# EAGLE board RFIDLER V22 beta (EAGLE 6.5.0), part 1 of 2
VERSION: 5
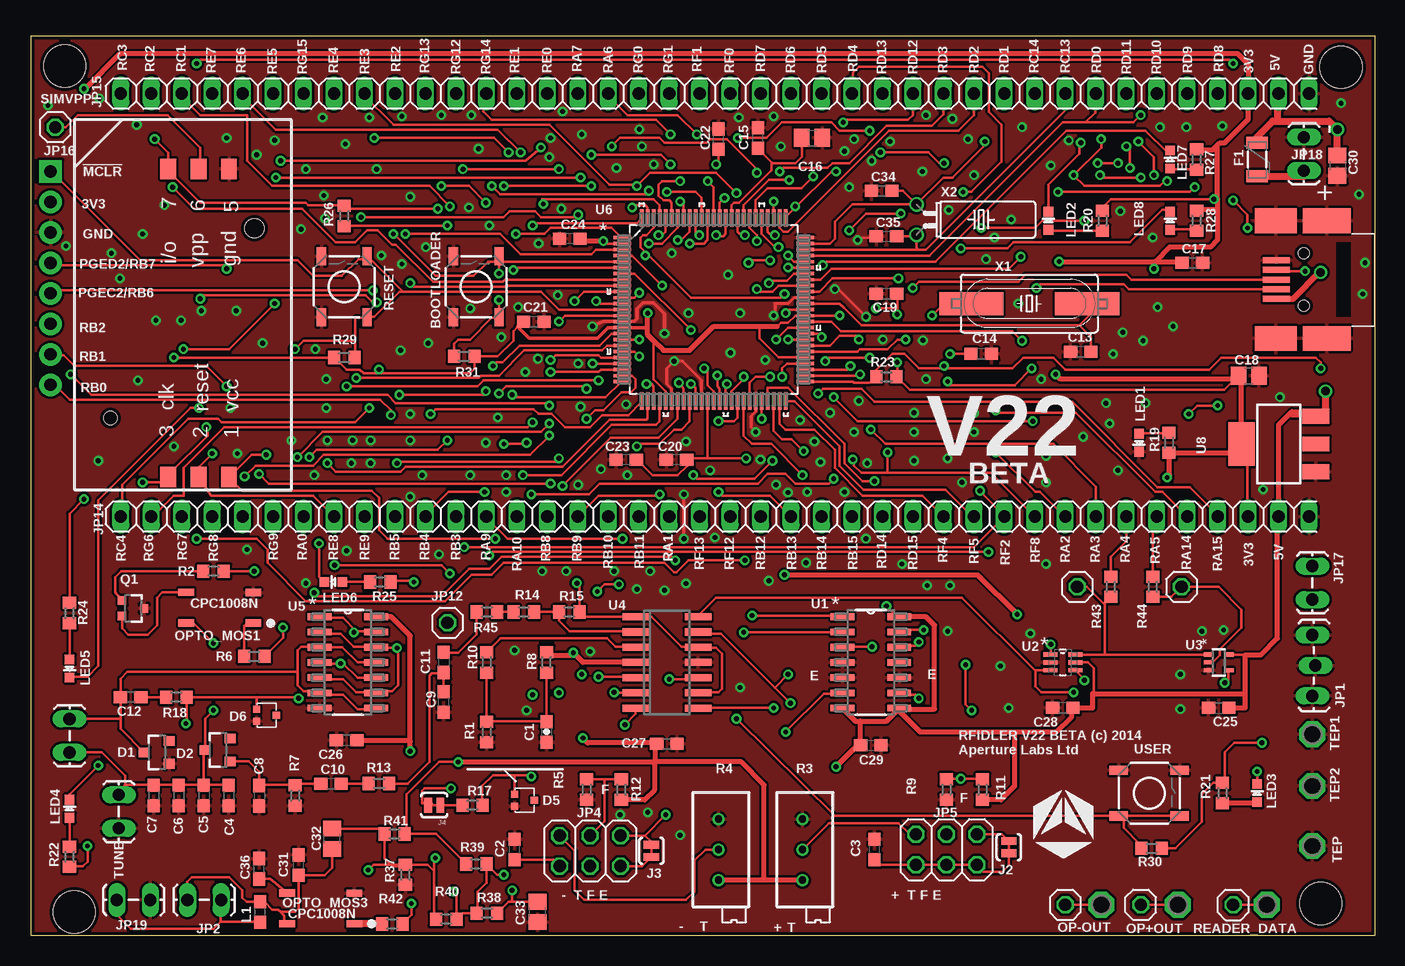
[diagram p2: board, top side]
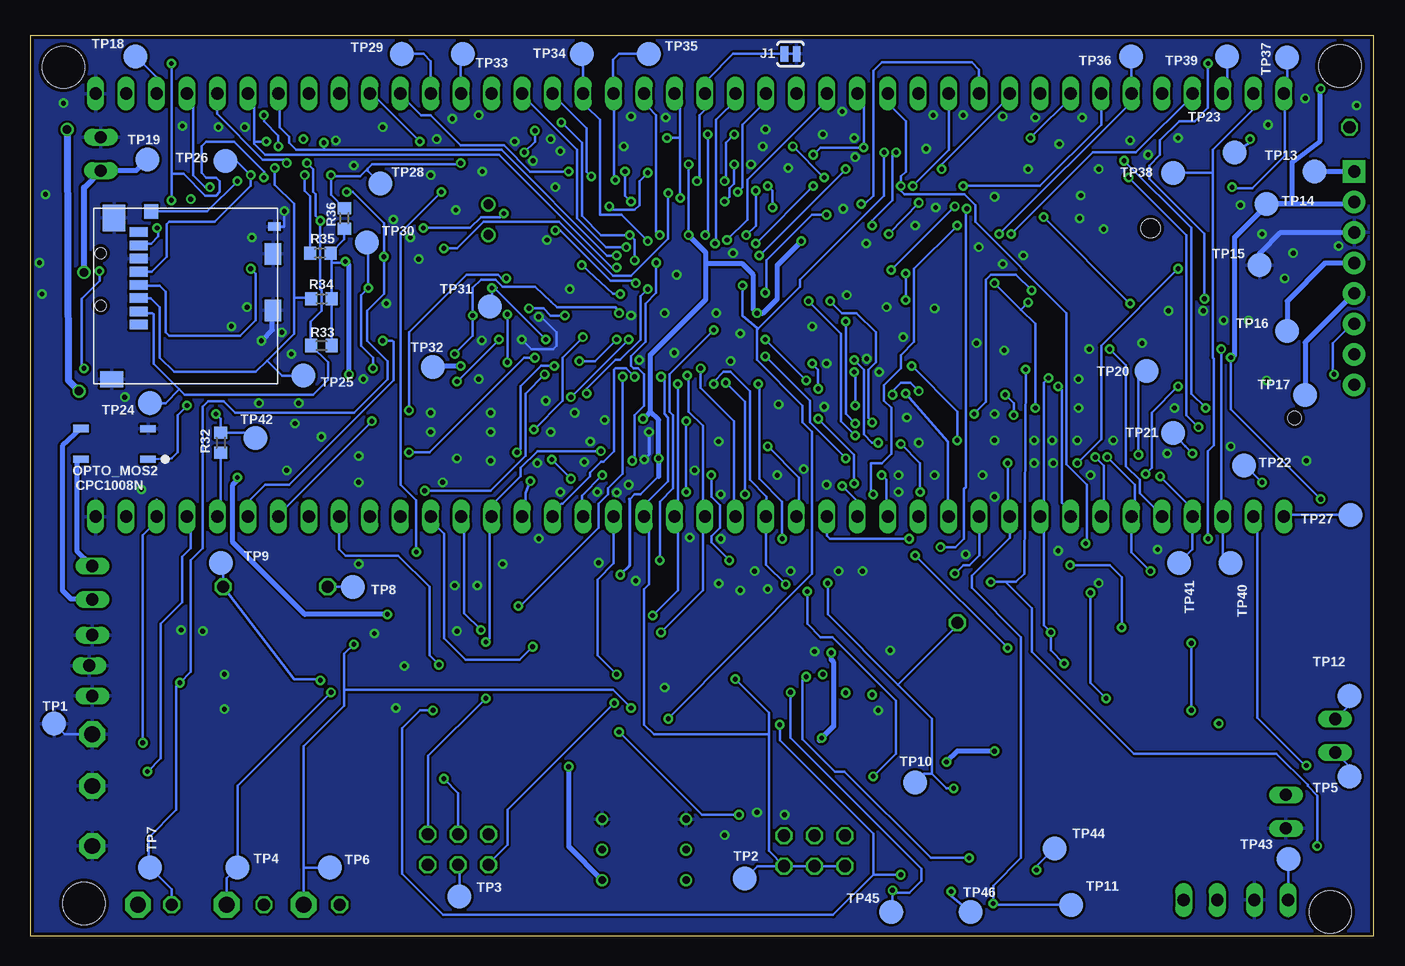
[diagram p3: board, bottom side, seen from below]

Size 112 x 75 mm. Coordinates in mm from the lower left corner, seen from the top.
Outline: 0,75 112,75 112,0 0,0 0,75
Copper layers (1*16): Top 0.035mm / dielectric 1.5mm / Bottom 0.035mm
Design rules "cleveland rfidler v20": minimum track width 0.2mm, minimum drill 0.4mm, track to track 0.2mm, track to pad 0.2mm, pad to pad 0.2mm, via to via 0.2mm, smd to smd 0.125mm, copper to edge 0.3mm, drill to drill 0.2mm, minimum pad ring 0.2mm, minimum via ring 0.2mm, stop-mask expansion 0.075mm, vias tented up to drill 0.5mm, thermal gap 0.2mm
Net classes: 1 power: width 0.25 mm, drill 0.4 mm, clearance 0.2 mm
Holes 3.5 mm at 2.8,72.5 3.6,2 109.2,72.4 107.5,2.7

## Footprints (pad centres in the part's own frame; a part is rotated, then mirrored left to right if it is on the bottom)
TACTILE_SWITCH_SMD = smd 1.524 x 0.762: 1 -2.54,1.905; 2 2.54,1.905; 3 -2.54,-1.905; 4 2.54,-1.905
0603-CAP = smd 1.1 x 1: 1 -0.85,0; 2 0.85,0
C0603 = smd 1.1 x 1: 1 -0.85,0; 2 0.85,0
C0805 = smd 1.3 x 1.5: 1 -0.85,0; 2 0.85,0
SOT23-3 = smd 0.8 x 0.9: 1 -0.95,-1; 2 0.95,-1; 3 0,1.1
SOT663 = smd 0.6 x 0.6: P$1 1.015,-0.5; P$2 1.015,0.5; P$3 -0.635,0
PTC-1206 = smd 1 x 1.8: 1 -1.4,0; 2 1.4,0
SJ_2S-TRACE = smd 0.635 x 1.27: 1 -0.508,0; 2 0.508,0
1X03_LOCK_LONGPADS = drill 1.016 long: 1 0,0; 2 2.54,-0.254; 3 5.08,0
1X02_LOCK_LONGPADS = drill 1.016 long: 1 -0.127,0; 2 2.667,0
2X03 = drill 1.016 octagon: 1 -2.54,-1.27; 2 -2.54,1.27; 3 0,-1.27; 4 0,1.27; 5 2.54,-1.27; 6 2.54,1.27
1X01 = drill 1.016 octagon: 1 0,0
1X40 = drill 1.016 long: 1 -49.53,0; 2 -46.99,0; 3 -44.45,0; 4 -41.91,0; 5 -39.37,0; 6 -36.83,0; 7 -34.29,0; 8 -31.75,0; 9 -29.21,0; 10 -26.67,0; 11 -24.13,0; 12 -21.59,0; 13 -19.05,0; 14 -16.51,0; 15 -13.97,0; 16 -11.43,0; 17 -8.89,0; 18 -6.35,0; 19 -3.81,0; 20 -1.27,0; 21 1.27,0; 22 3.81,0; 23 6.35,0; 24 8.89,0; 25 11.43,0; 26 13.97,0; 27 16.51,0; 28 19.05,0; 29 21.59,0; 30 24.13,0; 31 26.67,0; 32 29.21,0; 33 31.75,0; 34 34.29,0; 35 36.83,0; 36 39.37,0; 37 41.91,0; 38 44.45,0; 39 46.99,0; 40 49.53,0
1X08 = drill 1.016 pad 1.88 square: 1 0,0 | drill 1.016 pad 1.88: 2 2.54,0; 3 5.08,0; 4 7.62,0; 5 10.16,0; 6 12.7,0; 7 15.24,0; 8 17.78,0
0603 = smd 1.1 x 1: 1 -0.85,0; 2 0.85,0
LED-0603 = smd 0.8 x 0.8: A 0,-0.75; C 0,0.75
P1-13 = drill 1.321 pad 2.159 octagon: TP 0,0
CPC1008N = smd 0.6 x 1.3: A 1.27,2.54; C -1.27,2.54; COM -1.29,-3.06; NO 1.27,-3.06
SOT323 = smd 0.7 x 0.7: 1 -0.65,-0.925; 2 0.65,-0.925; 3 0,0.925
R0603 = smd 1 x 1.1: 1 -0.85,0; 2 0.85,0
RTRIMT93XA = drill 0.61: 1 0,-2.54; 2 0,0; 3 0,2.54
TP20R = smd 2 x 2: TP 0,0
SOIC127P600X175-14N = smd 1.981 x 0.559: 1 -2.362,3.81; 2 -2.362,2.54; 3 -2.362,1.27; 4 -2.362,0; 5 -2.362,-1.27; 6 -2.362,-2.54; 7 -2.362,-3.81; 8 2.362,-3.81; 9 2.362,-2.54; 10 2.362,-1.27; 11 2.362,0; 12 2.362,1.27; 13 2.362,2.54; 14 2.362,3.81
SOT65P210X110-6N = smd 1.168 x 0.356: 1 -1.041,0.66; 2 -1.041,0; 3 -1.041,-0.66; 4 1.041,-0.66; 5 1.041,0; 6 1.041,0.66
SC70-5L = smd 0.35 x 0.8: 1 -0.65,-0.85; 2 0,-0.85; 3 0.65,-0.85; 4 0.65,0.85; 5 -0.65,0.85
SO14 = smd 0.6 x 2.2: 1 -3.81,-2.6; 2 -2.54,-2.6; 3 -1.27,-2.6; 4 0,-2.6; 5 1.27,-2.6; 6 2.54,-2.6; 7 3.81,-2.6; 8 3.81,2.6; 9 2.54,2.6; 10 1.27,2.6; 11 0,2.6; 12 -1.27,2.6; 13 -2.54,2.6; 14 -3.81,2.6
QFP50P1600X1600X120-100N = smd 1.473 x 0.279: 1 -7.62,5.994; 2 -7.62,5.512; 3 -7.62,5.004; 4 -7.62,4.496; 5 -7.62,3.988; 6 -7.62,3.505; 7 -7.62,2.997; 8 -7.62,2.489; 9 -7.62,2.007; 10 -7.62,1.499; 11 -7.62,0.991; 12 -7.62,0.508; 13 -7.62,0; 14 -7.62,-0.508; 15 -7.62,-0.991; 16 -7.62,-1.499; 17 -7.62,-2.007; 18 -7.62,-2.489; 19 -7.62,-2.997; 20 -7.62,-3.505; 21 -7.62,-3.988; 22 -7.62,-4.496; 23 -7.62,-5.004; 24 -7.62,-5.512; 25 -7.62,-5.994; 51 7.62,-5.994; 52 7.62,-5.512; 53 7.62,-5.004; 54 7.62,-4.496; 55 7.62,-3.988; 56 7.62,-3.505; 57 7.62,-2.997; 58 7.62,-2.489; 59 7.62,-2.007; 60 7.62,-1.499; 61 7.62,-0.991; 62 7.62,-0.508; 63 7.62,0; 64 7.62,0.508; 65 7.62,0.991; 66 7.62,1.499; 67 7.62,2.007; 68 7.62,2.489; 69 7.62,2.997; 70 7.62,3.505; 71 7.62,3.988; 72 7.62,4.496; 73 7.62,5.004; 74 7.62,5.512; 75 7.62,5.994 | smd 0.279 x 1.473: 26 -5.994,-7.62; 27 -5.512,-7.62; 28 -5.004,-7.62; 29 -4.496,-7.62; 30 -3.988,-7.62; 31 -3.505,-7.62; 32 -2.997,-7.62; 33 -2.489,-7.62; 34 -2.007,-7.62; 35 -1.499,-7.62; 36 -0.991,-7.62; 37 -0.508,-7.62; 38 0,-7.62; 39 0.508,-7.62; 40 0.991,-7.62; 41 1.499,-7.62; 42 2.007,-7.62; 43 2.489,-7.62; 44 2.997,-7.62; 45 3.505,-7.62; 46 3.988,-7.62; 47 4.496,-7.62; 48 5.004,-7.62; 49 5.512,-7.62; 50 5.994,-7.62; 76 5.994,7.62; 77 5.512,7.62; 78 5.004,7.62; 79 4.496,7.62; 80 3.988,7.62; 81 3.505,7.62; 82 2.997,7.62; 83 2.489,7.62; 84 2.007,7.62; 85 1.499,7.62; 86 0.991,7.62; 87 0.508,7.62; 88 0,7.62; 89 -0.508,7.62; 90 -0.991,7.62; 91 -1.499,7.62; 92 -2.007,7.62; 93 -2.489,7.62; 94 -2.997,7.62; 95 -3.505,7.62; 96 -3.988,7.62; 97 -4.496,7.62; 98 -5.004,7.62; 99 -5.512,7.62; 100 -5.994,7.62
SIM_CARD_CONN = smd 1.7 x 1.3: CARD_CLK_PIN3 -10.16,5.08; CARD_GND_PIN5 15.52,0; CARD_IO_PIN7 15.52,5.08; CARD_RESET_PIN2 -10.16,2.54; CARD_VCC_PIN1 -10.16,0; CARD_VPP_PIN6 15.52,2.54 | hole 1.6: 10.58,-2.1 | hole 1.1: -5.22,9.9
SOT223 = smd 1.219 x 2.235: P$1 -2.311,-3.099; P$2@1 0,-3.099; P$3 2.311,-3.099 | smd 3.6 x 2.2: P$2@2 0,3.099
USB_MINI_B_FARN1125348 = smd 2.25 x 0.5: D+ 0,0; D- 0,0.8; GND 0,-1.6; ID 0,-0.8; VBUS 0,1.6 | smd 4 x 2.05: GND@1 -4.2,-4.9; GND@4 -4.2,4.9 | smd 3.5 x 2.05: GND@2 0.05,-4.9; GND@3 0.05,4.9 | hole 0.9: -2.3,2.2; -2.3,-2.2
MICROSD_TE2201778-1_FARN-234-5280 = smd 0.8 x 1.5: 1 3.85,-0.75; 2 2.75,-0.75; 3 1.65,-0.75; 4 0.55,-0.75; 5 -0.55,-0.75; 6 -1.65,-0.75; 7 -2.75,-0.75; 8 -3.85,-0.75 | smd 1.2 x 1.16: A -5.59,0.3 | smd 0.7 x 1.05: B -4.32,10.59 | smd 1.8 x 1.4: GND -2.04,10.45; GND@1 2.66,10.45 | smd 2.21 x 1.9: GND@2 -5.05,-2.8 | smd 1.35 x 1.9: GND@3 8.4,-3
HC49UP = smd 5.334 x 1.93: 1 -4.826,0; 2 4.826,0
TC38H = drill 0.813: 1 -1.27,0; 2 1.27,0

## Placement (x,y rotation side)
BOOTLOADER  [TACTILE_SWITCH_SMD]  37.1,54.1 90 top
C1  100nF  [0603-CAP]  42.96,17 270 top
C2  100nF  [C0603]  40.3,7.2 90 top
C3  100nF  [C0603]  70.3,7.2 90 top
C4  TUNE  [C0603]  16.45,11.7 270 top
C5  TUNE  [C0603]  14.4,11.7 270 top
C6  TUNE  [C0603]  12.3,11.7 270 top
C7  4.3nF  [C0603]  10.2,11.7 270 top
C8  1nF  [C0603]  19.02,11.69 270 top
C9  1nF  [C0603]  34.4,19.5 90 top
C10  15nf  [C0603]  25,12.7 0 top
C11  100nF  [C0603]  34.4,22.8 270 top
C12  1nF  [C0603]  8.3,19.9 180 top
C13  18pF  [C0603]  87.5,48.7 0 top
C14  18pF  [C0603]  79.2,48.5 180 top
C15  100nf  [C0603]  60.6,66.5 90 top
C16  10uF  [C0805]  65.1,66.5 0 top
C17  100nF  [C0603]  96.8,56.1 0 top
C18  22uF  [C0805]  101.5,46.7 0 top
C19  100nF  [C0603]  71.3,53.5 180 top
C20  100nF  [C0603]  53.8,39.7 180 top
C21  100nF  [C0603]  41.9,51.2 0 top
C22  100nf  [C0603]  57.3,66.4 90 top
C23  100nF  [C0603]  49.6,39.7 180 top
C24  100nF  [C0603]  44.9,58.1 180 top
C25  10nF  [C0603]  99,19 0 top
C26  10nF  [C0603]  26.3,16.3 180 top
C27  10nF  [C0603]  53,16.01 0 top
C28  10nF  [C0603]  86,19 180 top
C29  10nF  [C0603]  70,15.9 0 top
C30  10uF  [C0805]  108.9,64.2 270 top
C31  1nF  [C0603]  22.3,5.9 90 top
C32  10uF  [C0805]  25.1,8.1 90 top
C33  10uF  [C0805]  42.2,2 90 top
C34  12pF  [C0603]  70.9,62.1 0 top
C35  12pF  [C0603]  71.3,58.3 0 top
C36  1nF  [C0603]  19,5.6 90 top
D1  MMDB4148  [SOT23-3]  10.5,15.3 90 top
D2  MMDB4148  [SOT23-3]  15.6,15.5 90 top
D5  BZB984-C3V0  [SOT663]  41.3,11.3 180 top
D6  BZB984-C3V0  [SOT663]  19.8,18.4 180 top
F1  250ma  [PTC-1206]  102.2,64.7 270 top
J1  CUT TO USE RF1  [SJ_2S-TRACE]  48.6,73.5 0 bottom
J2  CUT TO USE FIXED R OR TRIM POT  [SJ_2S-TRACE]  81.5,7.4 90 top
J3  CUT TO USE FIXED R OR TRIM POT  [SJ_2S-TRACE]  51.7,7.1 90 top
J4  [SJ_2S-TRACE]  33.6,10.9 180 top
JP1  [1X03_LOCK_LONGPADS]  106.8,20 90 top
JP2  [1X02_LOCK_LONGPADS]  15.7,3 180 top
JP4  [2X03]  46.6,7.1 0 top
JP5  [2X03]  76.3,7.2 0 top
JP6  [1X01]  92.5,2.6 180 top
JP7  [1X01]  86.2,2.6 0 top
JP8  [1X01]  100.2,2.6 90 top
JP9  [1X01]  87.2,29.1 0 top
JP10  [1X01]  95.9,29.1 0 top
JP11  [1X02_LOCK_LONGPADS]  3.2,15.42 90 top
JP12  [1X01]  34.7,26.1 0 top
JP14  [1X40]  57,34.95 0 top
JP15  [1X40]  57,70.2 0 top
JP16  [1X08]  1.61,63.71 270 top
JP17  [1X02_LOCK_LONGPADS]  106.8,30.7 270 top
JP18  [1X02_LOCK_LONGPADS]  106.1,63.9 90 top
JP19  [1X02_LOCK_LONGPADS]  9.8,3 180 top
L1  [0603]  19.1,2 90 top
LED1  POWER blue  [LED-0603]  92.35,41.1 180 top
LED2  ERROR red  [LED-0603]  84.8,59.6 0 top
LED3  USER_LED yel  [LED-0603]  102.2,11.9 0 top
LED4  READ grn  [LED-0603]  3.2,10.6 0 top
LED5  EMULATE red  [LED-0603]  3.2,22.3 180 top
LED6  CLOCK oran  [LED-0603]  25.2,29.5 90 top
LED7  COMMS ACTIVITY yel  [LED-0603]  94.95,64.7 0 top
LED8  USB grn  [LED-0603]  94.95,59.6 0 top
OP+OUT  TPPAD1-13  [P1-13]  95.6,2.6 90 top
OP-OUT  TPPAD1-13  [P1-13]  89.2,2.6 0 top
OPTO_MOS1  CPC1008N  [CPC1008N]  15.98,27.35 270 top
OPTO_MOS2  CPC1008N  [CPC1008N]  104.7,41 270 bottom
OPTO_MOS3  CPC1008N  [CPC1008N]  24.4,2.3 270 top
Q1  2N3904  [SOT323]  8.5,27.3 270 top
R1  100K  [R0603]  37.97,17 270 top
R2  1k  [R0603]  15.2,30.4 0 top
R3  100k  [RTRIMT93XA]  64.3,7.2 180 top
R4  100k  [RTRIMT93XA]  57.3,7.2 180 top
R5  100k  [R0603]  46.3,12.2 270 top
R6  330  [R0603]  18.6,23.3 180 top
R7  1M  [R0603]  22.01,11.7 90 top
R8  100K  [R0603]  42.96,22.8 270 top
R9  100k  [R0603]  76.3,12.2 270 top
R10  1M  [R0603]  37.97,22.8 90 top
R11  100k  [R0603]  79.3,12.2 90 top
R12  100k  [R0603]  49.2,12.2 90 top
R13  8K06  [R0603]  29,12.7 180 top
R14  4k7  [R0603]  41.07,27 180 top
R15  220K  [R0603]  44.86,27 180 top
R17  470  [R0603]  36.8,10.9 180 top
R18  470  [R0603]  12.1,19.9 180 top
R19  330  [R0603]  94.85,41.1 270 top
R20  330  [R0603]  89.3,59.6 90 top
R21  330  [R0603]  99.3,11.9 90 top
R22  330  [R0603]  3.2,6.6 270 top
R23  10k  [R0603]  71.3,46.6 180 top
R24  330  [R0603]  3.2,26.9 90 top
R25  330  [R0603]  29.1,29.5 0 top
R26  4K7  [R0603]  26.1,60 90 top
R27  330  [R0603]  97.15,64.7 90 top
R28  330  [R0603]  97.15,59.6 90 top
R29  10K  [R0603]  26.1,48.2 0 top
R30  10K  [R0603]  93.4,7.3 180 top
R31  10K  [R0603]  36.1,48.3 180 top
R32  330  [R0603]  96.1,41.1 90 bottom
R33  10K  [R0603]  87.7,49.2 180 bottom
R34  10K  [R0603]  87.7,53.1 180 bottom
R35  10K  [R0603]  87.8,56.9 180 bottom
R36  10K  [R0603]  85.8,59.8 90 bottom
R37  100K  [R0603]  31.2,5.1 270 top
R38  47K  [R0603]  38,1.9 180 top
R39  1K  [R0603]  37.1,6 180 top
R40  100K  [R0603]  34.6,1.4 180 top
R41  100K  [R0603]  30.3,8.5 180 top
R42  330  [R0603]  30.1,1 180 top
R43  0R  [R0603]  90,29.1 90 top
R44  0R  [R0603]  93.5,29.1 90 top
R45  12K  [R0603]  38,27 180 top
READER_DATA  TPPAD1-13  [P1-13]  103,2.6 270 top
RESET  [TACTILE_SWITCH_SMD]  26.1,54.1 90 top
SIMVPP  [1X01]  2,67.4 0 top
TEP  TPPAD1-13  [P1-13]  106.8,7.5 180 top
TEP1  TPPAD1-13  [P1-13]  106.8,16.8 180 top
TEP2  TPPAD1-13  [P1-13]  106.8,12.5 180 top
TP1  DOWNS_ORIN1  [TP20R]  110,17.7 0 bottom
TP2  DIV-  [TP20R]  52.4,4.8 0 bottom
TP3  DIV+  [TP20R]  76.2,3.3 0 bottom
TP4  OP-OUT  [TP20R]  94.7,5.7 0 bottom
TP5  COIL_B  [TP20R]  2,13.3 0 bottom
TP6  OP+OUT  [TP20R]  87,5.7 0 bottom
TP7  READER_DATA  [TP20R]  102,5.7 0 bottom
TP8  UPS_ORIN1  [TP20R]  85.1,29.1 0 bottom
TP9  DOWNS_ORIN1  [TP20R]  96.1,31.1 0 bottom
TP10  RAW_READER_OUT  [TP20R]  38.2,12.8 0 bottom
TP11  LC_CAL  [TP20R]  25.2,2.6 0 bottom
TP12  COIL_A  [TP20R]  2,20 0 bottom
TP13  !MCLR  [TP20R]  4.9,63.7 0 bottom
TP14  3V3  [TP20R]  8.9,61 0 bottom
TP15  GND  [TP20R]  9.5,55.9 0 bottom
TP16  PGD2  [TP20R]  7.2,50.4 0 bottom
TP17  PGC2  [TP20R]  5.7,45.1 0 bottom
TP18  DOWNS_ORIN1  [TP20R]  103.2,73.3 0 bottom
TP19  POWER_IN_5V0  [TP20R]  102.2,64.7 0 bottom
TP20  SMARTCARD_VCC  [TP20R]  18.9,47.1 0 bottom
TP21  SMARTCARD_RESET  [TP20R]  16.7,41.9 0 bottom
TP22  SMARTCARD_CLOCK  [TP20R]  10.8,39.2 0 bottom
TP23  SMARTCARD_TX_PIC_RX  [TP20R]  11.6,65.3 0 bottom
TP24  PIC_!SS1  [TP20R]  102,44.4 0 bottom
TP25  PIC_SDO1  [TP20R]  89.2,46.7 0 bottom
TP26  PIC_SCK1  [TP20R]  95.7,64.6 0 bottom
TP27  PIC_SDI1  [TP20R]  1.9,35.1 0 bottom
TP28  SD_CARD_DETECT  [TP20R]  82.8,62.7 0 bottom
TP29  WIEGAND_1_OUT  [TP20R]  81,73.5 90 bottom
TP30  USB_D-  [TP20R]  83.9,57.8 0 bottom
TP31  USB_D+  [TP20R]  73.67,52.46 0 bottom
TP32  USBID  [TP20R]  78.4,47.4 0 bottom
TP33  WIE0OUT  [TP20R]  75.9,73.5 90 bottom
TP34  WIE0IN  [TP20R]  66,73.5 90 bottom
TP35  WIE1IN  [TP20R]  60.4,73.5 90 bottom
TP36  DEBUG_4  [TP20R]  20.2,73.3 0 bottom
TP37  DEBUG_3  [TP20R]  7.2,73.2 0 bottom
TP38  DEBUG_2  [TP20R]  16.7,63.6 270 bottom
TP39  DEBUG_1  [TP20R]  12.2,73.3 0 bottom
TP40  CLI_UART3_PIC_RX  [TP20R]  11.9,31.1 270 bottom
TP41  CLI_UART3_PIC_TX  [TP20R]  16.2,31.1 270 bottom
TP42  RELAY  [TP20R]  93.2,41.5 0 bottom
TP43  LC_COIL  [TP20R]  7.1,6.4 270 bottom
TP44  LC+  [TP20R]  26.6,7.3 270 bottom
TP45  LC-  [TP20R]  40.2,2 270 bottom
TP46  LCOUT  [TP20R]  33.6,2 270 bottom
TP47  PEG4  [TP20R]  3.6,2 0 bottom
TP48  PEG1  [TP20R]  107.5,2.7 0 bottom
TP49  PEG3  [TP20R]  2.8,72.5 0 bottom
TP50  PEG2  [TP20R]  109.2,72.4 0 bottom
TUNE  [1X02_LOCK_LONGPADS]  7.3,9.1 90 top
U1  MCP4261-104E/SL  [SOIC127P600X175-14N]  70,22.8 0 top
U2  SN74LVC2G17DCKR  [SOT65P210X110-6N]  86,22.8 0 top
U3  SN74AHC1G32DCKR  [SC70-5L]  99,22.8 270 top
U4  LM324D  [SO14]  53,22.8 270 top
U5  SN74AHCT125D  [SOIC127P600X175-14N]  26.4,22.8 0 top
U6  PIC32MX795F512L-80I/PF  [QFP50P1600X1600X120-100N]  56.9,52.2 0 top
U7  SIMCARD_HOLDER_SMALL  [SIM_CARD_CONN]  16.5,48.4 90 top
U8  LDO-SOT223-REG  [SOT223]  104,41 90 top
U$1  [AP_LOGO_5MM_SILK]  86.1,9 0 top
U$2  USB_MINI_B_FARN1125348  [USB_MINI_B_FARN1125348]  103.8,54.7 180 top
USD_1  MICROSD_TE2201778-1_FARN-234-5280  [MICROSD_TE2201778-1_FARN-234-5280]  102.2,54.8 270 bottom
USER  [TACTILE_SWITCH_SMD]  93.2,11.9 0 top
X1  8MHz  [HC49UP]  83.2,52.7 180 top
X2  32.768KHZ  [TC38H]  73.8,59.7 270 top